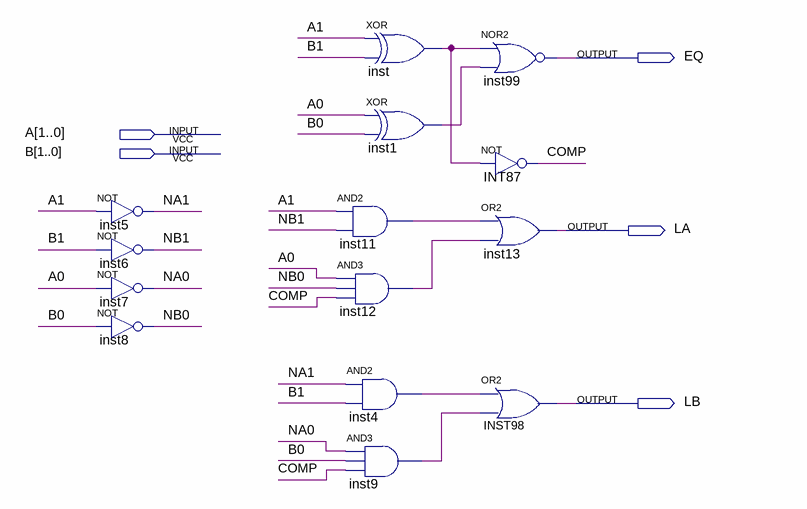
[diagram p0: schematic sheet]
// Quartus schematic COMP2.bdf as structural Verilog: 14 symbols, 5 pins
module COMP2 (
  input  [1:0] A,
  input  [1:0] B,
  output EQ,
  output LA,
  output LB
);

  wire COMP, inst1_out, inst4_out, inst9_out, inst11_out, inst12_out, inst_out, NA0, NA1, NB0, NB1;

  not inst5 (NA1, A[1]);
  not inst6 (NB1, B[1]);
  not inst7 (NA0, A[0]);
  not inst8 (NB0, B[0]);
  xor inst (inst_out, A[1], B[1]);
  xor inst1 (inst1_out, A[0], B[0]);
  and inst11 (inst11_out, A[1], NB1);
  and inst12 (inst12_out, A[0], NB0, COMP);
  and inst4 (inst4_out, NA1, B[1]);
  and inst9 (inst9_out, NA0, B[0], COMP);
  nor inst99 (EQ, inst_out, inst1_out);
  not INT87 (COMP, inst_out);
  or inst13 (LA, inst11_out, inst12_out);
  or INST98 (LB, inst4_out, inst9_out);
endmodule
